# Altium project 3D_Scanner_Gesamt.PrjPcb
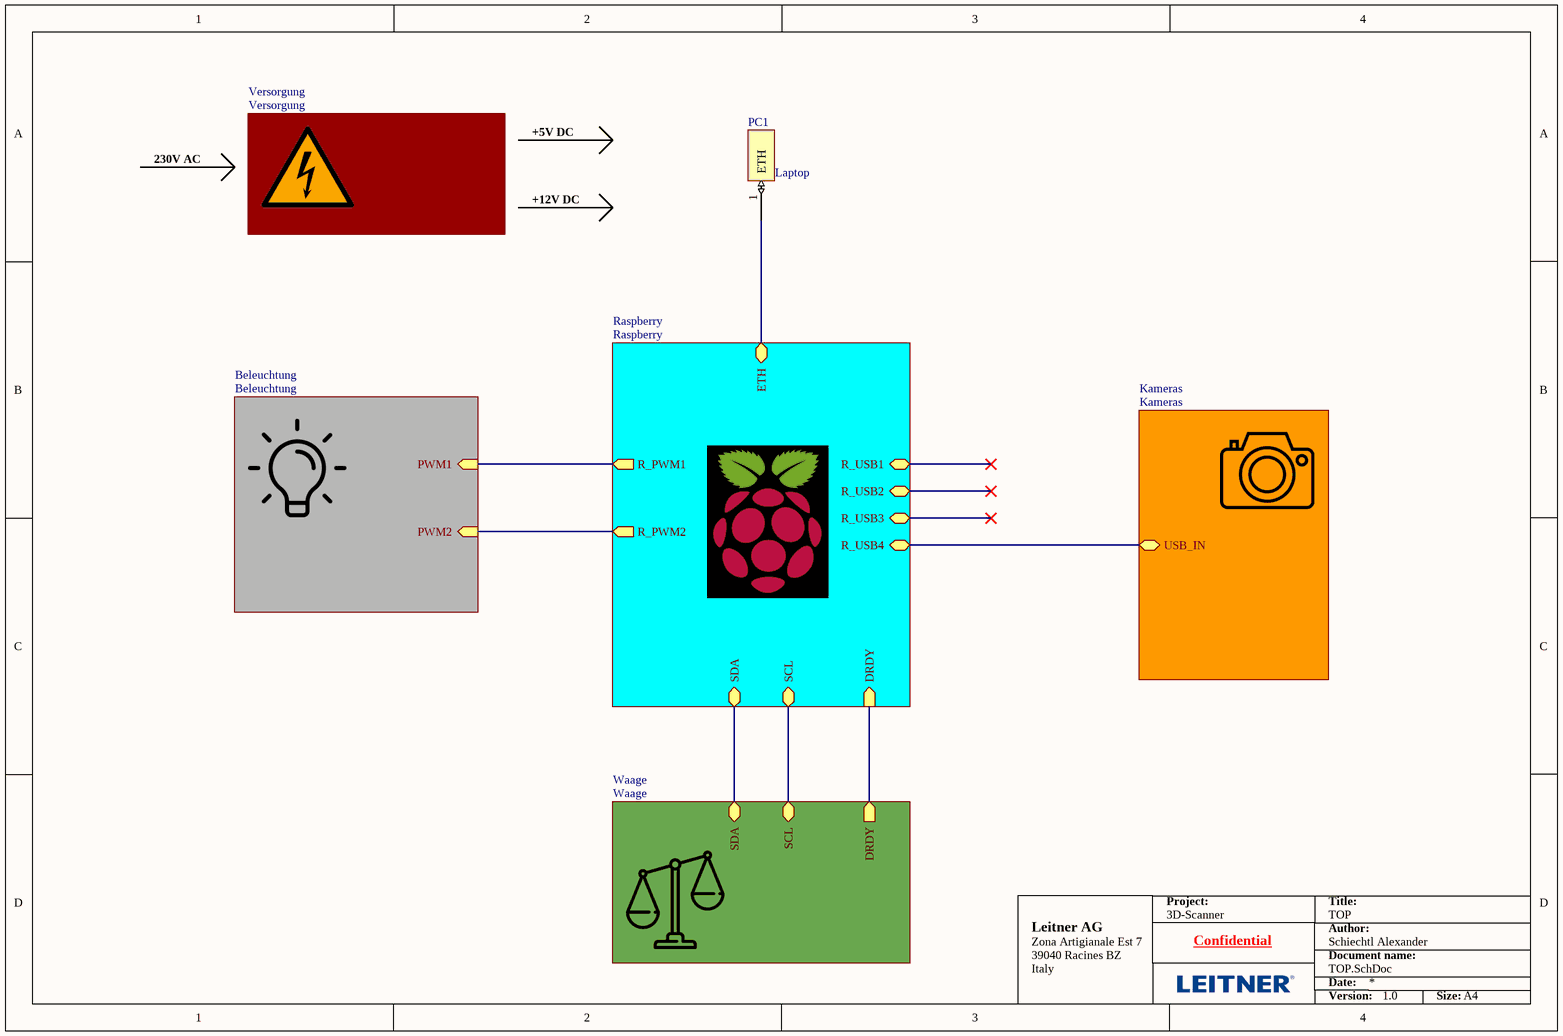
[diagram p0: TOP.SchDoc]
6 sheets, 34 parts. Net scope: hierarchical (ports join the sheet entries above them; power ports are global).
Sheets:
  TOP.SchDoc
    Kameras = Kameras.SchDoc
    Versorgung = Versorgung.SchDoc
    Raspberry = Raspberry.SchDoc
    Waage = Waage.SchDoc
    Beleuchtung = Beleuchtung.SchDoc

## Sheet TOP.SchDoc: TOP
size A4; Author: Schiechtl Alexander; Revision: 1.0; SheetNumber: 1; SheetTotal: 6; Project: 3D-Scanner

### Parts
PC1  Laptop

### Sub-sheets
Beleuchtung = Beleuchtung: PWM1 (in), PWM2 (in)
Kameras = Kameras: USB_IN (bidir)
Raspberry = Raspberry: R_USB1 (bidir), R_USB2 (bidir), R_USB3 (bidir), R_USB4 (bidir), SCL (bidir), SDA (bidir), DRDY (in), ETH (bidir), R_PWM1 (out), R_PWM2 (out)
Versorgung = Versorgung: no entries
Waage = Waage: SCL (bidir), SDA (bidir), DRDY (out)

### Nets
NetHUB1_2: sheet Kameras/USB_IN, sheet Raspberry/R_USB4
NetMUX1_3: sheet Raspberry/SDA, sheet Waage/SDA
NetMUX1_4: sheet Raspberry/SCL, sheet Waage/SCL
NetPC1_1: PC1.1(ETH) ; sheet Raspberry/ETH
NetR_RGB1_0: sheet Raspberry/R_PWM1, sheet Beleuchtung/PWM1
NetR_RGB2_0: sheet Raspberry/R_PWM2, sheet Beleuchtung/PWM2

### Buses and harness runs
bus sheet Raspberry/DRDY = sheet Waage/DRDY

### Notes on the sheet
- 230V AC
- +5V DC
- +12V DC
- Project:
- Title:
- Leitner AG
- Zona Artigianale Est 7
- 39040 Racines BZ
- Italy
- Confidential
- Author:
- Document name:
- Date:
- Version:
- Size:
- A4

## Sheet Kameras.SchDoc: Kameras
size A4; Author: Schiechtl Alexander; SheetNumber: 2; SheetTotal: 6; Project: 3D_Scanner
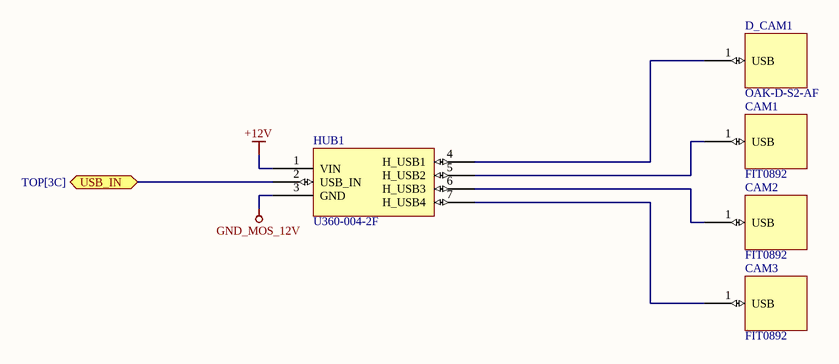
[diagram p1: Kameras.SchDoc]

### Parts
CAM1  FIT0892
CAM2  FIT0892
CAM3  FIT0892
D_CAM1  OAK-D-S2-AF
HUB1  U360-004-2F

### Ports
USB_IN (bidir, see TOP[3C])

### Nets
+12V: HUB1.1(VIN)
GND_MOS_12V: HUB1.3(GND)
NetCAM1_1: CAM1.1(USB) HUB1.5(H_USB2)
NetCAM2_1: CAM2.1(USB) HUB1.6(H_USB3)
NetCAM3_1: CAM3.1(USB) HUB1.7(H_USB4)
NetD_CAM1_1: D_CAM1.1(USB) HUB1.4(H_USB1)
NetHUB1_2: HUB1.2(USB_IN) ; port USB_IN

### Notes on the sheet
- Project:
- Title:
- Leitner AG
- Zona Artigianale Est 7
- 39040 Racines BZ
- Italy
- Confidential
- Author:
- Document name:
- Date:
- Version:
- Size:
- A4

### Library data of the parts
CAM1-CAM3 = USB Kamera: Cameras & Camera Modules Megapixel 720p USB Wide-angle Camera for Raspberry Pi and NVIDIA Jetson Nano
D_CAM1 = Depth Kamera: Cameras & Camera Modules Robotic Perception Camera Series 2 with Auto Fcous, Stereo Depth, Object Tracking, Computer Vision, 4 TOPS of Processing Power for AI
HUB1 = USB HUB: Interface Modules 4PT USB3.0 SSSPD HUB/CHARGER

## Sheet Versorgung.SchDoc: Netzteil
size A4; Date: 10.11.2025; Author: Alexander Schiechtl; Revision: v1.0; SheetNumber: 4; SheetTotal: 6; Project: 3D-Scanner
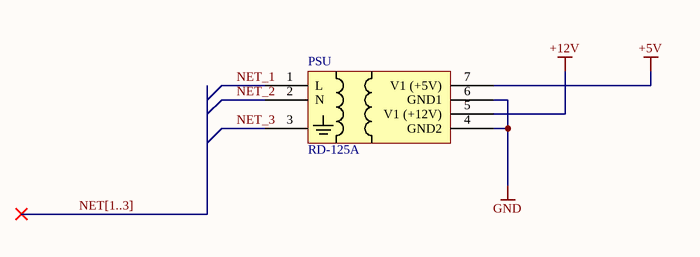
[diagram p2: Versorgung.SchDoc]

### Parts
PSU  RD-125A

### Nets
+5V: PSU.7(V1_(+5V))
+12V: PSU.5(V1_(+12V))
GND: PSU.4(GND2) PSU.6(GND1)
NET_1: PSU.1(L)
NET_2: PSU.2(N)
NET_3: PSU.3

### Buses and harness runs
bus NET[1..3]

### Notes on the sheet
- Project:
- Title:
- Leitner AG
- Zona Artigianale Est 7
- 39040 Racines BZ
- Italy
- Confidential
- Author:
- Document name:
- Date:
- Version:
- Size:
- A4

### Library data of the parts
PSU = PSU: MEAN WELL Schaltnetzteil, 5 V dc, 12 V dc / 7.7A 2-Kanal 130.9W 176 → 264 V ac, 248 → 373 V dc, 88

## Sheet Raspberry.SchDoc
size A4; SheetNumber: 3; SheetTotal: 6; SPICEModelCacheFICJDGAN: <root> / <DocumentId>FICJDGAN</DocumentId> / <CacheFrame Number="0"> / <Model Name="irlz44n" Kind="CKT"> / <Text>.SUBCKT irlz44n 1 2 3 / ************************************** / *      Model Generated by MODPEX     * / *Copyright(c) Symmetry Design Systems* / *         All Rights Reserved        * / *    UNPUBLISHED LICENSED SOFTWARE   * / *   Contains Proprietary Information * / *      Which is The Property of      * / *     SYMMETRY OR ITS LICENSORS      * / *Commercial Use or Resale Restricted * / *   by Symmetry License Agreement    * / ************************************** / * Model generated on Apr 24, 96 / * Model format: SPICE3 / * Symmetry POWER MOS Model (Version 1.0) / * External Node Designations / * Node 1 -&gt; Drain / * Node 2 -&gt; Gate / * Node 3 -&gt; Source / M1 9 7 8 8 MM L=100u W=100u / * Default values used in MM: / * The voltage-dependent capacitances are / * not included. Other default values are: / *   RS=0 RD=0 LD=0 CBD=0 CBS=0 CGBO=0 / .MODEL MM NMOS LEVEL=1 IS=1e-32 / +VTO=2.08819 LAMBDA=0.0038193 KP=67.9211 / +CGSO=1.59143e-05 CGDO=3.04562e-08 / RS 8 3 0.014066 / D1 3 1 MD / .MODEL MD D IS=4.4574e-09 RS=0.007275 N=1.40246 BV=55 / +IBV=0.00025 EG=1.14011 XTI=3.00078 TT=0 / +CJO=8.92434e-10 VJ=4.94724 M=0.75496 FC=0.5 / RDS 3 1 2.2e+06 / RD 9 1 0.00179971 / RG 2 7 2.4114 / D2 4 5 MD1 / * Default values used in MD1: / *   RS=0 EG=1.11 XTI=3.0 TT=0 / *   BV=infinite IBV=1mA / .MODEL MD1 D IS=1e-32 N=50 / +CJO=1.15401e-09 VJ=0.859156 M=0.642548 FC=1e-08 / D3 0 5 MD2 / * Default values used in MD2: / *   EG=1.11 XTI=3.0 TT=0 CJO=0 / *   BV=infinite IBV=1mA / .MODEL MD2 D IS=1e-10 N=0.4 RS=3e-06 / RL 5 10 1 / FI2 7 9 VFI2 -1 / VFI2 4 0 0 / EV16 10 0 9 7 1 / CAP 11 10 3.64838e-09 / FI1 7 9 VFI1 -1 / VFI1 11 6 0 / RCAP 6 10 1 / D4 0 6 MD3 / * Default values used in MD3: / *   EG=1.11 XTI=3.0 TT=0 CJO=0 / *   RS=0 BV=infinite IBV=1mA / .MODEL MD3 D IS=1e-10 N=0.4 / .ENDS</Text> / </Model> / <Model Name="di_1n4001" Kind="MDL"> / <Text>*************************************************************************************************************************************** / *SRC=1N4001;DI_1N4001;Diodes;Si;  50.0V  1.00A  3.00us   Diodes, Inc. diode / .MODEL DI_1N4001 D  ( IS=76.9p RS=42.0m BV=50.0 IBV=5.00u / + CJO=39.8p  M=0.333 N=1.45 TT=4.32u )</Text> / </Model> / </CacheFrame> / </root>
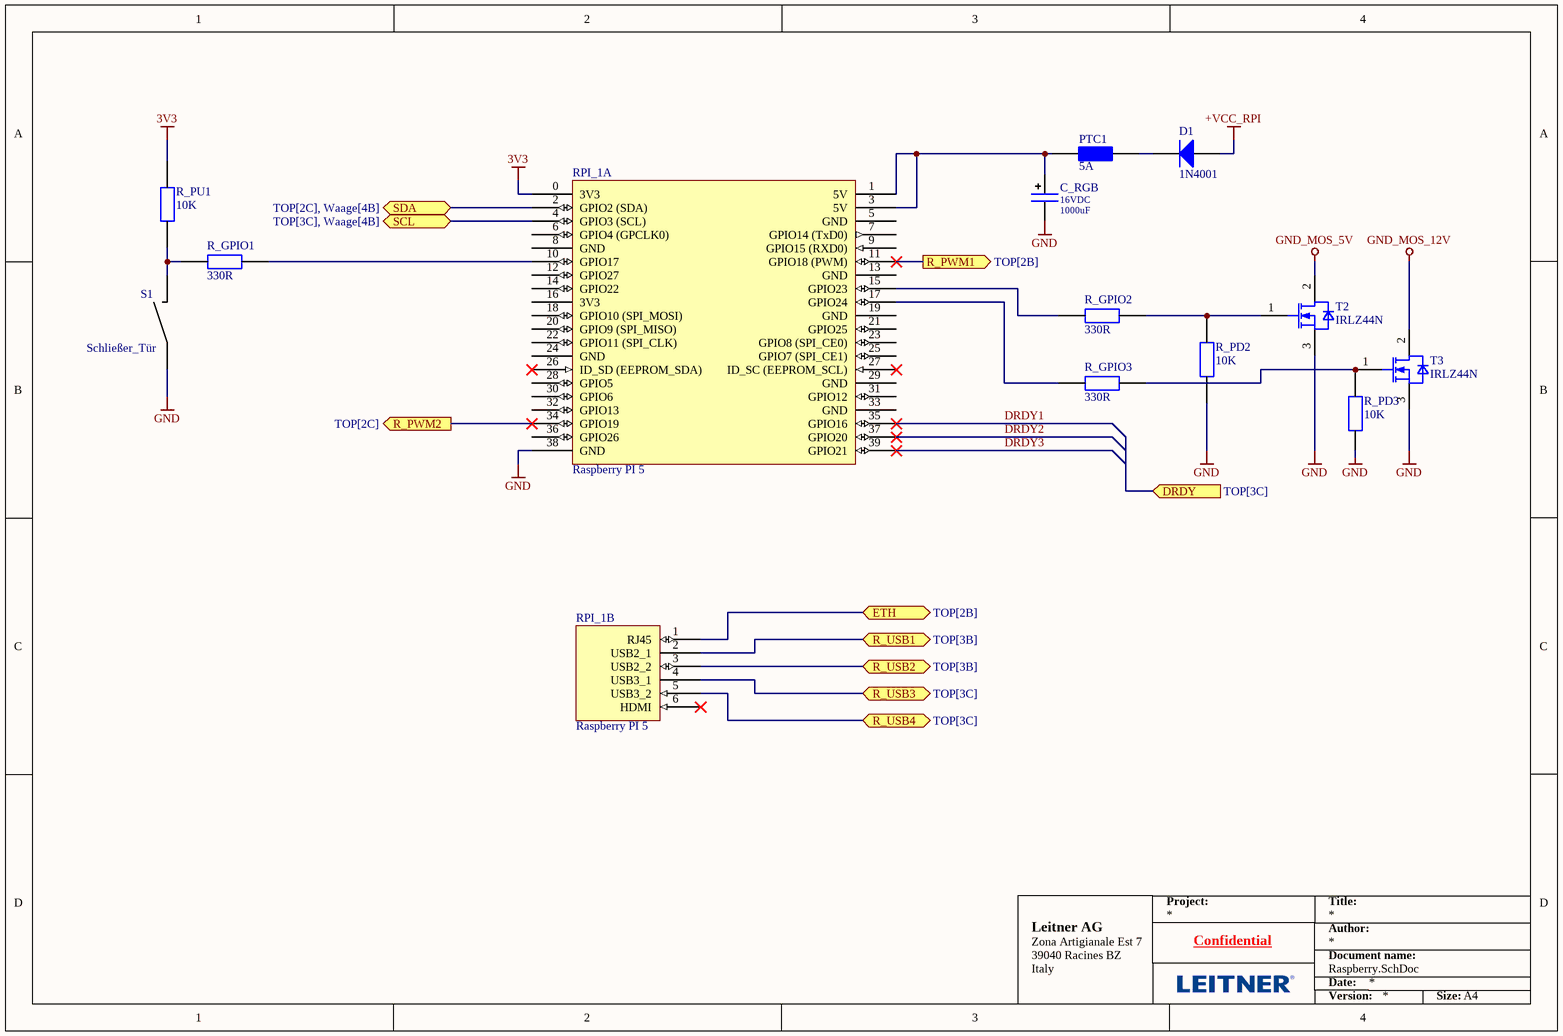
[diagram p3: Raspberry.SchDoc]

### Parts
C_RGB  Spannung: 16VDC  (hidden comment: 1000uF)
D1  1N4001  [D_DO41-RM4]
PTC1  5A
R_GPIO1  330R
R_GPIO2  330R
R_GPIO3  330R
R_PD2  10K
R_PD3  10K
R_PU1  10K
RPI_1  Raspberry PI 5  (parts A,B of 2)
S1  Schließer_Tür
T2  IRLZ44N
T3  IRLZ44N

### Ports
DRDY (in, see TOP[3C]), ETH (bidir, see TOP[2B]), R_PWM1 (out, see TOP[2B]), R_PWM2 (out, see TOP[2C]), R_USB1 (bidir, see TOP[3B]), R_USB2 (bidir, see TOP[3B]), R_USB3 (bidir, see TOP[3C]), R_USB4 (bidir, see TOP[3C]), SCL (bidir, see TOP[3C], Waage[4B]), SDA (bidir, see TOP[2C], Waage[4B])

### Nets
3V3: R_PU1.1 RPI_1.0(3V3)
+VCC_RPI: D1.A
GND: C_RGB.0 R_PD2.0 R_PD3.0 RPI_1.38(GND) T2.3(SOURCE) T3.3(SOURCE)
GND_MOS_5V: T2.2(DRAIN)
GND_MOS_12V: T3.2(DRAIN)
DRDY1: RPI_1.35(GPIO16)
DRDY2: RPI_1.37(GPIO20)
DRDY3: RPI_1.39(GPIO21)
NetC_RGB_1: C_RGB.1 PTC1.0 RPI_1.1(5V) RPI_1.3(5V)
NetD1_C: D1.C(K) PTC1.1
NetHUB1_2: RPI_1.5(GND) ; port R_USB4
NetMUX1_3: RPI_1.2(GPIO2_(SDA)) ; port SDA
NetMUX1_4: RPI_1.4(GPIO3_(SCL)) ; port SCL
NetPC1_1: RPI_1.1(RJ45) ; port ETH
NetR_GPIO1_0: R_GPIO1.0 R_PU1.0
NetR_GPIO1_1: R_GPIO1.1 RPI_1.10(GPIO17)
NetR_GPIO2_0: R_GPIO2.0 RPI_1.15(GPIO23)
NetR_GPIO2_1: R_GPIO2.1 R_PD2.1 T2.1(GATE)
NetR_GPIO3_0: R_GPIO3.0 RPI_1.17(GPIO24)
NetR_GPIO3_1: R_GPIO3.1 R_PD3.1 T3.1(GATE)
NetR_RGB1_0: RPI_1.11(GPIO18_(PWM)) ; port R_PWM1
NetR_RGB2_0: RPI_1.34(GPIO19) ; port R_PWM2
NetRPI_1_2: RPI_1.2(USB2_1) ; port R_USB1
NetRPI_1_3: RPI_1.3(USB2_2) ; port R_USB2
NetRPI_1_4: RPI_1.4(USB3_1) ; port R_USB3

Not connected (* = marked no-connect by the designer): RPI_1 6(GPIO4_(GPCLK0)) 7(GPIO14_(TxD0)) 8(GND) 9(GPIO15_(RXD0)) 12(GPIO27) 13(GND) 14(GPIO22) 16(3V3) 18(GPIO10_(SPI_MOSI)) 19(GND) 20(GPIO9_(SPI_MISO)) 21(GPIO25) 22(GPIO11_(SPI_CLK)) 23(GPIO8_(SPI_CE0)) 24(GND) 25(GPIO7_(SPI_CE1)) 26(ID_SD_(EEPROM_SDA))* 27(ID_SC_(EEPROM_SCL))* 28(GPIO5) 29(GND) 30(GPIO6) 31(GPIO12) 32(GPIO13) 33(GND) 36(GPIO26)

### Notes on the sheet
- Project:
- Title:
- Leitner AG
- Zona Artigianale Est 7
- 39040 Racines BZ
- Italy
- Confidential
- Author:
- Document name:
- Date:
- Version:
- Size:
- A4

### Library data of the parts
C_RGB = Elko 1000uF: Ladung: 1000uF
D1 = 1N4001: Si-Diode; 50V, 1.00A, 3.00us (Diodes, Inc.); Usage: only permitted for non-commercial purposes at HTL I Innsbruck; SimulationModellSource: Diodes Incorporated; Published: 21-Feb-2011; LatestRevisionDate: 01-Nov-2012
PTC1 = PTC 5A: Current: 5A
R_GPIO1-R_GPIO3 = R 330: Widerstand: 330R
R_PD2 R_PD3 R_PU1 = R 10K: Widerstand: 10K
RPI_1 = Raspberry PI
S1 = S_Schließer
T2 T3 = IRLZ44N: OptiMOS 3 Power-Transistor, VDS 100V; Manufacturer: Infineon Technologies; Manufacturer Order Number: IRLZ44N; PackageReference: PG-TO220-3-904

## Sheet Waage.SchDoc
size A4; SheetNumber: 5; SheetTotal: 6
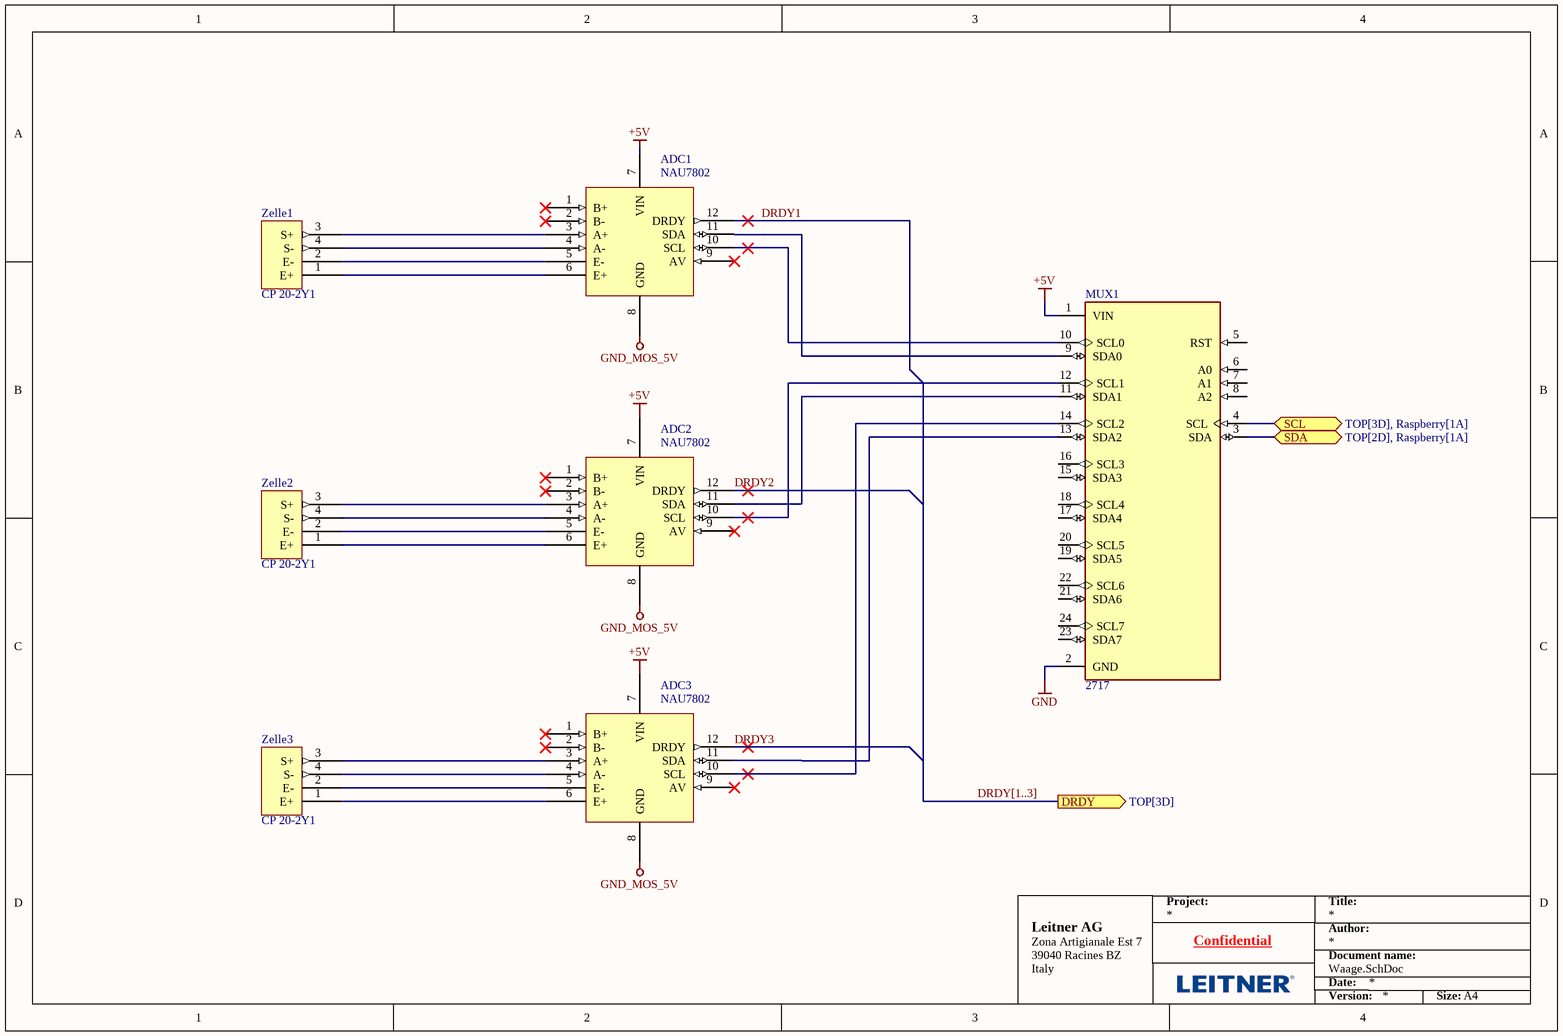
[diagram p4: Waage.SchDoc]

### Parts
ADC1  NAU7802
ADC2  NAU7802
ADC3  NAU7802
MUX1  2717  [MODULE_2717]
Zelle1  CP 20-2Y1
Zelle2  CP 20-2Y1
Zelle3  CP 20-2Y1

### Ports
DRDY (out, see TOP[3D]), SCL (bidir, see TOP[3D], Raspberry[1A]), SDA (bidir, see TOP[2D], Raspberry[1A])

### Nets
+5V: ADC1.7(VIN) ADC2.7(VIN) ADC3.7(VIN) MUX1.1(VIN)
GND: MUX1.2(GND)
GND_MOS_5V: ADC1.8(GND) ADC2.8(GND) ADC3.8(GND)
DRDY1: ADC1.12(DRDY)
DRDY2: ADC2.12(DRDY)
DRDY3: ADC3.12(DRDY)
NetADC1_3: ADC1.3(A+) Zelle1.3(S+)
NetADC1_4: ADC1.4(A-) Zelle1.4(S-)
NetADC1_5: ADC1.5(E-) Zelle1.2(E-)
NetADC1_6: ADC1.6(E+) Zelle1.1(E+)
NetADC1_10: ADC1.10(SCL) MUX1.10(SCL0)
NetADC1_11: ADC1.11(SDA) MUX1.9(SDA0)
NetADC2_3: ADC2.3(A+) Zelle2.3(S+)
NetADC2_4: ADC2.4(A-) Zelle2.4(S-)
NetADC2_5: ADC2.5(E-) Zelle2.2(E-)
NetADC2_6: ADC2.6(E+) Zelle2.1(E+)
NetADC2_10: ADC2.10(SCL) MUX1.12(SCL1)
NetADC2_11: ADC2.11(SDA) MUX1.11(SDA1)
NetADC3_3: ADC3.3(A+) Zelle3.3(S+)
NetADC3_4: ADC3.4(A-) Zelle3.4(S-)
NetADC3_5: ADC3.5(E-) Zelle3.2(E-)
NetADC3_6: ADC3.6(E+) Zelle3.1(E+)
NetADC3_10: ADC3.10(SCL) MUX1.14(SCL2)
NetADC3_11: ADC3.11(SDA) MUX1.13(SDA2)
NetMUX1_3: MUX1.3(SDA) ; port SDA
NetMUX1_4: MUX1.4(SCL) ; port SCL

Not connected (* = marked no-connect by the designer): ADC1 1(B+)* 2(B-)* 9(AV)*; ADC2 1(B+)* 2(B-)* 9(AV)*; ADC3 1(B+)* 2(B-)* 9(AV)*; MUX1 5(RST) 6(A0) 7(A1) 8(A2) 15(SDA3) 16(SCL3) 17(SDA4) 18(SCL4) 19(SDA5) 20(SCL5) 21(SDA6) 22(SCL6) 23(SDA7) 24(SCL7)

### Buses and harness runs
bus DRDY[1..3] = port DRDY

### Notes on the sheet
- Project:
- Title:
- Leitner AG
- Zona Artigianale Est 7
- 39040 Racines BZ
- Italy
- Confidential
- Author:
- Document name:
- Date:
- Version:
- Size:
- A4

### Library data of the parts
ADC1-ADC3 = ADC: ADAFRUIT NAU7802 24-BIT ADC - ST
MUX1 = 2717: Module: multiplexer; I2C interface multiplexer; TCA9548A; 3Ã·5VDC; MF: Adafruit; SnapEDA_Link: https://www.snapeda.com/parts/2717/Adafruit+Industries/view-part/?ref=snap; Package: None; Value: *; MP: 2717; Check_prices: https://www.snapeda.com/parts/2717/Adafruit+Industries/view-part/?ref=eda
Zelle1-Zelle3 = Wägezelle: Kern CP 20-2Y1 Wägezelle

## Sheet Beleuchtung.SchDoc: Beleuchtung
size A4; Date: 10.11.2025; Author: Alexander Schiechtl; Revision: v1.0; SheetNumber: 6; SheetTotal: 6; Project: 3D-Scanner
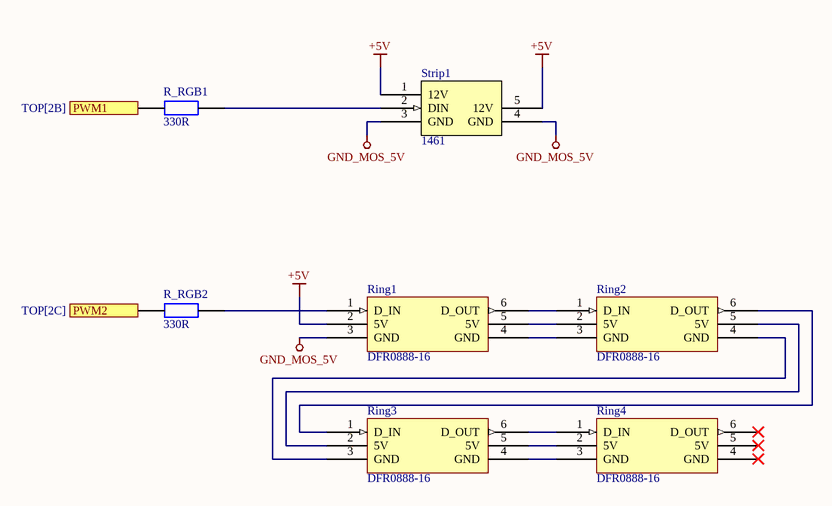
[diagram p5: Beleuchtung.SchDoc]

### Parts
R_RGB1  330R
R_RGB2  330R
Ring1  DFR0888-16
Ring2  DFR0888-16
Ring3  DFR0888-16
Ring4  DFR0888-16
Strip1  1461

### Ports
PWM1 (in, see TOP[2B]), PWM2 (in, see TOP[2C])

### Nets
+5V: Ring1.2(5V) Strip1.1(12V) Strip1.5(12V)
GND_MOS_5V: Ring1.3(GND) Strip1.3(GND) Strip1.4(GND)
NetR_RGB1_0: R_RGB1.0 ; port PWM1
NetR_RGB1_1: R_RGB1.1 Strip1.2(DIN)
NetR_RGB2_0: R_RGB2.0 ; port PWM2
NetR_RGB2_1: R_RGB2.1 Ring1.1(D_IN)
NetRing1_4: Ring1.4(GND) Ring2.3(GND)
NetRing1_5: Ring1.5(5V) Ring2.2(5V)
NetRing1_6: Ring1.6(D_OUT) Ring2.1(D_IN)
NetRing2_4: Ring2.4(GND) Ring3.3(GND)
NetRing2_5: Ring2.5(5V) Ring3.2(5V)
NetRing2_6: Ring2.6(D_OUT) Ring3.1(D_IN)
NetRing3_4: Ring3.4(GND) Ring4.3(GND)
NetRing3_5: Ring3.5(5V) Ring4.2(5V)
NetRing3_6: Ring3.6(D_OUT) Ring4.1(D_IN)

Not connected (* = marked no-connect by the designer): Ring4 4(GND)* 5(5V)* 6(D_OUT)*

### Notes on the sheet
- Project:
- Title:
- Leitner AG
- Zona Artigianale Est 7
- 39040 Racines BZ
- Italy
- Confidential
- Author:
- Document name:
- Date:
- Version:
- Size:
- A4

### Library data of the parts
R_RGB1 R_RGB2 = R 330: Widerstand: 330R
Ring1-Ring4 = RGB Ring: DFRobot, DFR0888-16. / WS2812-16 RGB LED RING LAMP
Strip1 = RGB Strip: ADDRESS LED STRIP SERIAL RGB 4M, Adafruit, 1461

## Nets that join several sheets
+5V: Versorgung (PSU.7), Waage (ADC1.7 ADC2.7 ADC3.7 MUX1.1), Beleuchtung (Ring1.2 Strip1.1 Strip1.5)
+12V: Kameras (HUB1.1), Versorgung (PSU.5)
GND: Versorgung (PSU.4 PSU.6), Raspberry (6 pins), Waage (MUX1.2)
GND_MOS_5V: Raspberry (T2.2), Waage (ADC1.8 ADC2.8 ADC3.8), Beleuchtung (Ring1.3 Strip1.3 Strip1.4)
GND_MOS_12V: Kameras (HUB1.3), Raspberry (T3.2)
NetHUB1_2: Kameras (HUB1.2), Raspberry (RPI_1.5)
NetMUX1_3: Raspberry (RPI_1.2), Waage (MUX1.3)
NetMUX1_4: Raspberry (RPI_1.4), Waage (MUX1.4)
NetPC1_1: TOP (PC1.1), Raspberry (RPI_1.1)
NetR_RGB1_0: Raspberry (RPI_1.11), Beleuchtung (R_RGB1.0)
NetR_RGB2_0: Raspberry (RPI_1.34), Beleuchtung (R_RGB2.0)